# Altium schematic sheet 0024_DDR5 SODIMM CONTRO.SchDoc
size A3
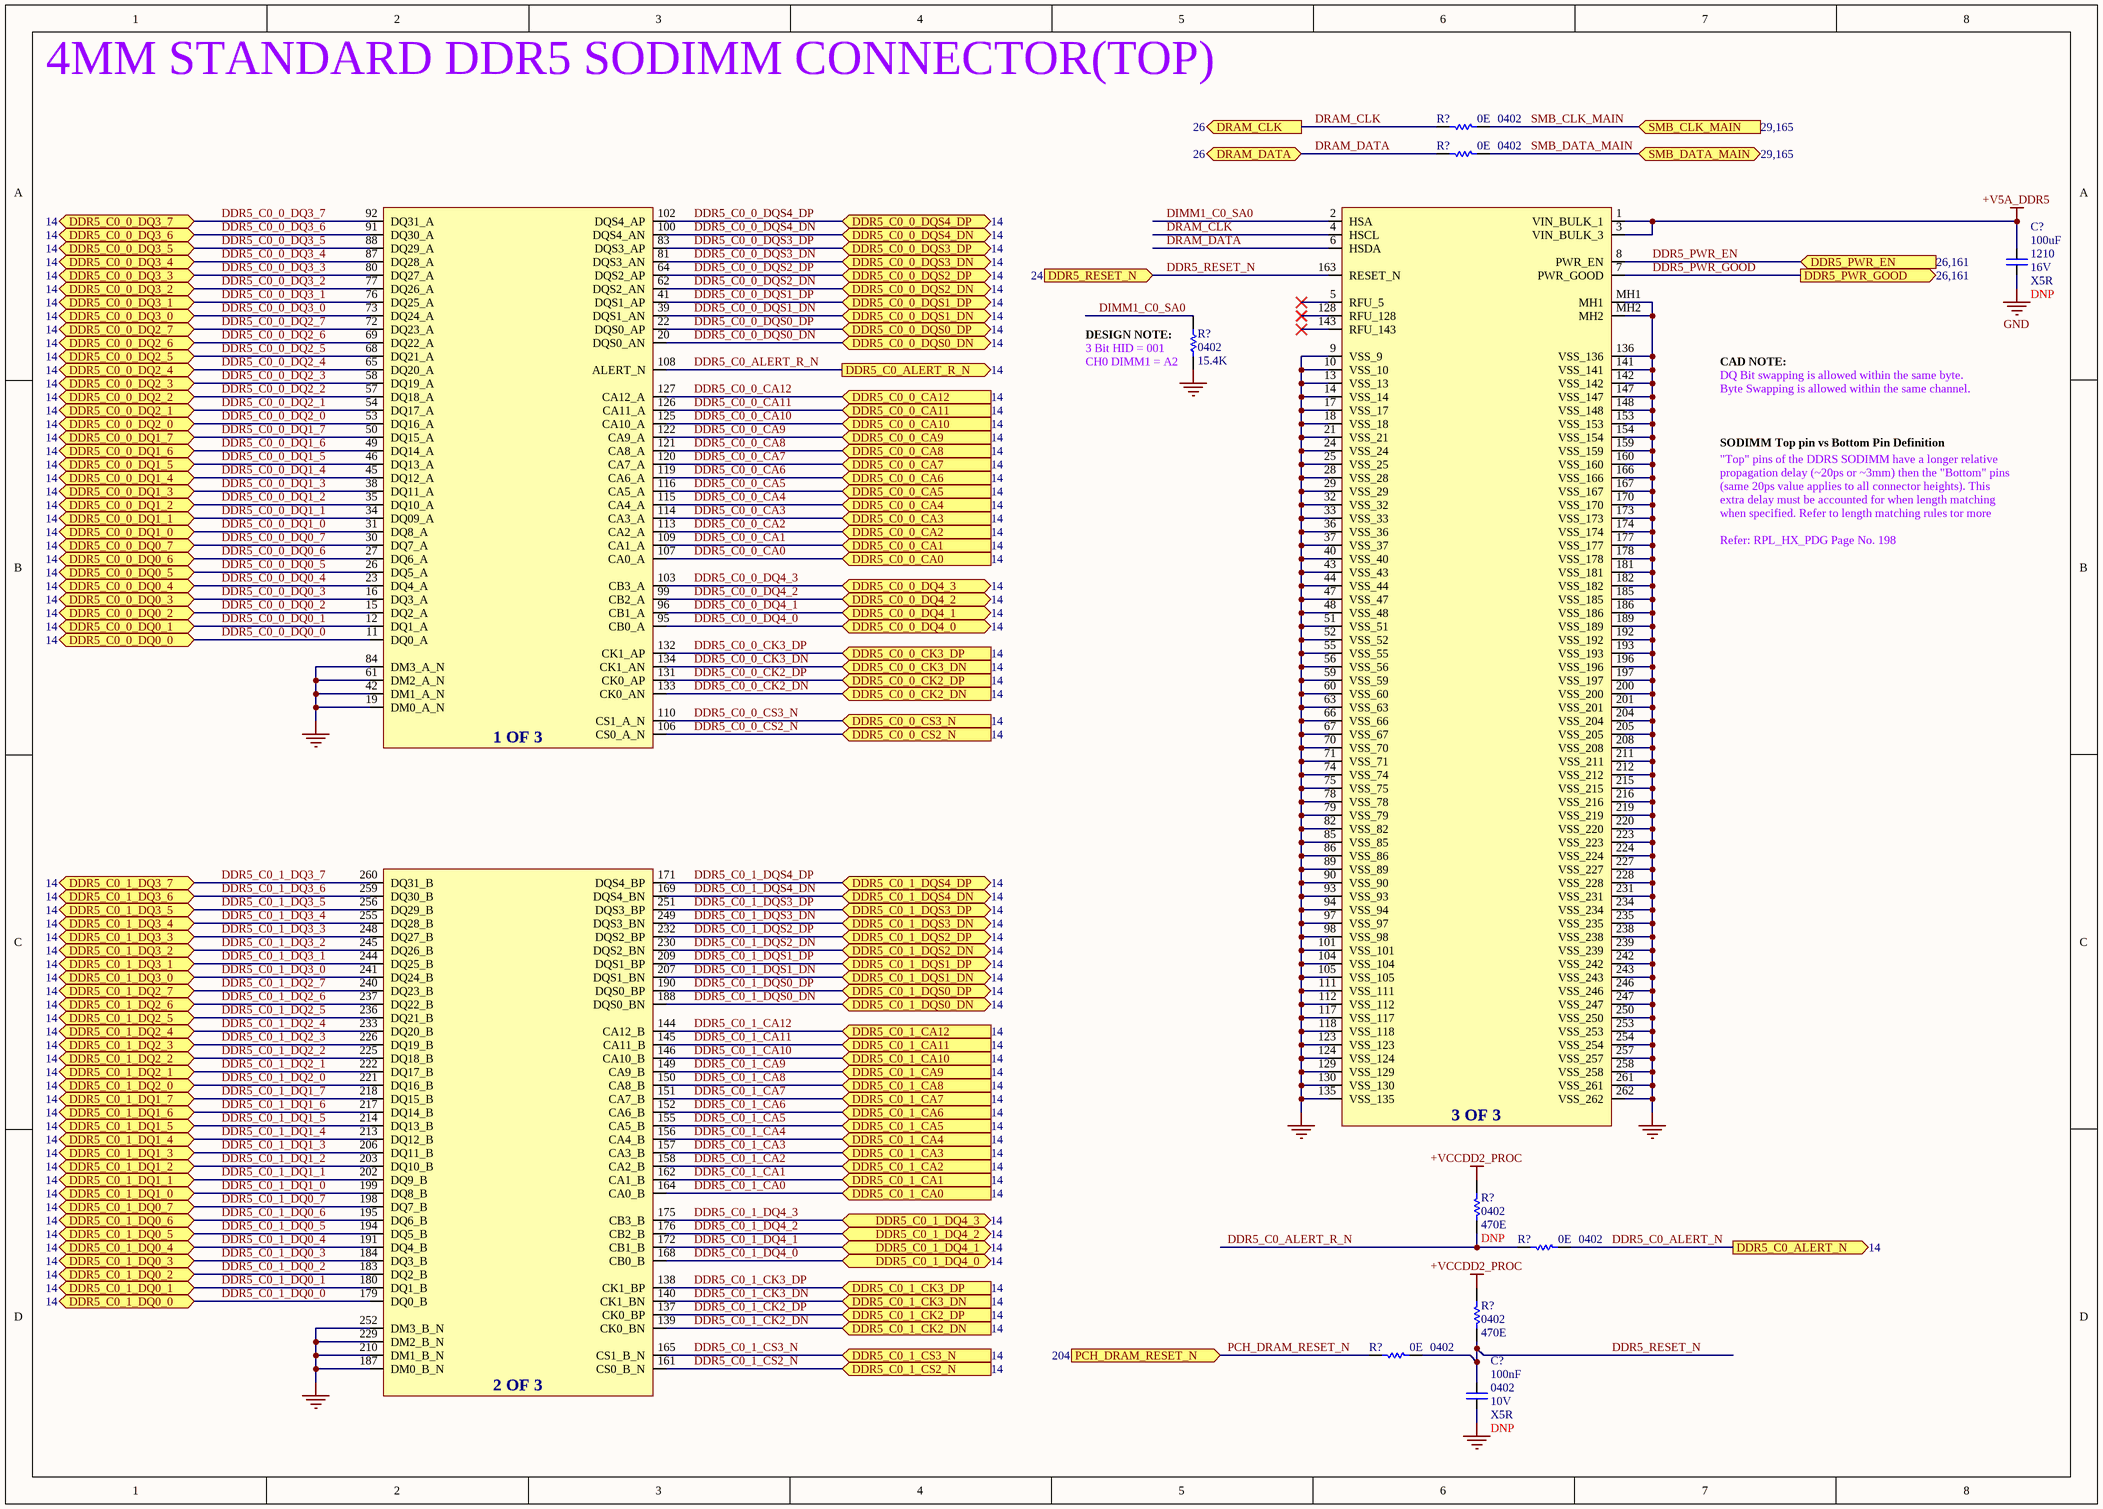
[diagram p0: 0024_DDR5 SODIMM CONTRO.SchDoc]

## Parts
(Parts that share a designator on the sheet are numbered #1, #2 ... from top to bottom, then left to right.)
C?#1  value 100uF  Case/Package: 1210  Voltage: 16V  Dielectric: X5R
C?#2  value 100nF  Case/Package: 0402  Voltage: 10V  Dielectric: X5R  [CAPC0402]
J2301  C_DDR5_SODIMM_2X131_2EM  (value not drawn)  (parts A,B,C of 3)
R?#1  value 0E  Case/Package: 0402  [RESC0402]  (hidden comment: Res)
R?#2  value 0E  Case/Package: 0402  [RESC0402]  (hidden comment: Res)
R?#3  value 15.4K  Case/Package: 0402  [RESC0402]  (hidden comment: Res)
R?#4  value 470E  Case/Package: 0402  [RESC0402]  (hidden comment: Res)
R?#5  value 0E  Case/Package: 0402  [RESC0402]  (hidden comment: Res)
R?#6  value 470E  Case/Package: 0402  [RESC0402]  (hidden comment: Res)
R?#7  value 0E  Case/Package: 0402  [RESC0402]  (hidden comment: Res)

## Ports
DDR5_C0_0_CA0 (in), DDR5_C0_0_CA1 (in), DDR5_C0_0_CA2 (in), DDR5_C0_0_CA3 (in), DDR5_C0_0_CA4 (in), DDR5_C0_0_CA5 (in), DDR5_C0_0_CA6 (in), DDR5_C0_0_CA7 (in), DDR5_C0_0_CA8 (in), DDR5_C0_0_CA9 (in), DDR5_C0_0_CA10 (in), DDR5_C0_0_CA11 (in), DDR5_C0_0_CA12 (in), DDR5_C0_0_CK2_DN (in), DDR5_C0_0_CK2_DP (in), DDR5_C0_0_CK3_DN (in), DDR5_C0_0_CK3_DP (in), DDR5_C0_0_CS2_N (in), DDR5_C0_0_CS3_N (in), DDR5_C0_0_DQ0_0 (bidir), DDR5_C0_0_DQ0_1 (bidir), DDR5_C0_0_DQ0_2 (bidir), DDR5_C0_0_DQ0_3 (bidir), DDR5_C0_0_DQ0_4 (bidir), DDR5_C0_0_DQ0_5 (bidir), DDR5_C0_0_DQ0_6 (bidir), DDR5_C0_0_DQ0_7 (bidir), DDR5_C0_0_DQ1_0 (bidir), DDR5_C0_0_DQ1_1 (bidir), DDR5_C0_0_DQ1_2 (bidir), DDR5_C0_0_DQ1_3 (bidir), DDR5_C0_0_DQ1_4 (bidir), DDR5_C0_0_DQ1_5 (bidir), DDR5_C0_0_DQ1_6 (bidir), DDR5_C0_0_DQ1_7 (bidir), DDR5_C0_0_DQ2_0 (bidir), DDR5_C0_0_DQ2_1 (bidir), DDR5_C0_0_DQ2_2 (bidir), DDR5_C0_0_DQ2_3 (bidir), DDR5_C0_0_DQ2_4 (bidir), DDR5_C0_0_DQ2_5 (bidir), DDR5_C0_0_DQ2_6 (bidir), DDR5_C0_0_DQ2_7 (bidir), DDR5_C0_0_DQ3_0 (bidir), DDR5_C0_0_DQ3_1 (bidir), DDR5_C0_0_DQ3_2 (bidir), DDR5_C0_0_DQ3_3 (bidir), DDR5_C0_0_DQ3_4 (bidir), DDR5_C0_0_DQ3_5 (bidir), DDR5_C0_0_DQ3_6 (bidir), DDR5_C0_0_DQ3_7 (bidir), DDR5_C0_0_DQ4_0 (bidir), DDR5_C0_0_DQ4_1 (bidir), DDR5_C0_0_DQ4_2 (bidir), DDR5_C0_0_DQ4_3 (bidir), DDR5_C0_0_DQS0_DN (bidir), DDR5_C0_0_DQS0_DP (bidir), DDR5_C0_0_DQS1_DN (bidir), DDR5_C0_0_DQS1_DP (bidir), DDR5_C0_0_DQS2_DN (bidir), DDR5_C0_0_DQS2_DP (bidir), DDR5_C0_0_DQS3_DN (bidir), DDR5_C0_0_DQS3_DP (bidir), DDR5_C0_0_DQS4_DN (bidir), DDR5_C0_0_DQS4_DP (bidir), DDR5_C0_1_CA0 (in), DDR5_C0_1_CA1 (in), DDR5_C0_1_CA2 (in), DDR5_C0_1_CA3 (in), DDR5_C0_1_CA4 (in), DDR5_C0_1_CA5 (in), DDR5_C0_1_CA6 (in), DDR5_C0_1_CA7 (in), DDR5_C0_1_CA8 (in), DDR5_C0_1_CA9 (in), DDR5_C0_1_CA10 (in), DDR5_C0_1_CA11 (in), DDR5_C0_1_CA12 (in), DDR5_C0_1_CK2_DN (in), DDR5_C0_1_CK2_DP (in), DDR5_C0_1_CK3_DN (in), DDR5_C0_1_CK3_DP (in), DDR5_C0_1_CS2_N (in), DDR5_C0_1_CS3_N (in), DDR5_C0_1_DQ0_0 (bidir), DDR5_C0_1_DQ0_1 (bidir), DDR5_C0_1_DQ0_2 (bidir), DDR5_C0_1_DQ0_3 (bidir), DDR5_C0_1_DQ0_4 (bidir), DDR5_C0_1_DQ0_5 (bidir), DDR5_C0_1_DQ0_6 (bidir), DDR5_C0_1_DQ0_7 (bidir), DDR5_C0_1_DQ1_0 (bidir), DDR5_C0_1_DQ1_1 (bidir), DDR5_C0_1_DQ1_2 (bidir), DDR5_C0_1_DQ1_3 (bidir), DDR5_C0_1_DQ1_4 (bidir), DDR5_C0_1_DQ1_5 (bidir), DDR5_C0_1_DQ1_6 (bidir), DDR5_C0_1_DQ1_7 (bidir), DDR5_C0_1_DQ2_0 (bidir), DDR5_C0_1_DQ2_1 (bidir), DDR5_C0_1_DQ2_2 (bidir), DDR5_C0_1_DQ2_3 (bidir), DDR5_C0_1_DQ2_4 (bidir), DDR5_C0_1_DQ2_5 (bidir), DDR5_C0_1_DQ2_6 (bidir), DDR5_C0_1_DQ2_7 (bidir), DDR5_C0_1_DQ3_0 (bidir), DDR5_C0_1_DQ3_1 (bidir), DDR5_C0_1_DQ3_2 (bidir), DDR5_C0_1_DQ3_3 (bidir), DDR5_C0_1_DQ3_4 (bidir), DDR5_C0_1_DQ3_5 (bidir), DDR5_C0_1_DQ3_6 (bidir), DDR5_C0_1_DQ3_7 (bidir), DDR5_C0_1_DQ4_0 (bidir), DDR5_C0_1_DQ4_1 (bidir), DDR5_C0_1_DQ4_2 (bidir), DDR5_C0_1_DQ4_3 (bidir), DDR5_C0_1_DQS0_DN (bidir), DDR5_C0_1_DQS0_DP (bidir), DDR5_C0_1_DQS1_DN (bidir), DDR5_C0_1_DQS1_DP (bidir), DDR5_C0_1_DQS2_DN (bidir), DDR5_C0_1_DQS2_DP (bidir), DDR5_C0_1_DQS3_DN (bidir), DDR5_C0_1_DQS3_DP (bidir), DDR5_C0_1_DQS4_DN (bidir), DDR5_C0_1_DQS4_DP (bidir), DDR5_C0_ALERT_N (out), DDR5_C0_ALERT_R_N (out), DDR5_PWR_EN (in), DDR5_PWR_GOOD (out), DDR5_RESET_N (in), DRAM_CLK (out), DRAM_DATA (bidir), PCH_DRAM_RESET_N (in), SMB_CLK_MAIN (in), SMB_DATA_MAIN (bidir)

## Nets
+V5A_DDR5: C?#1.1 J2301.1(VIN_BULK_1) J2301.3(VIN_BULK_3)
+VCCDD2_PROC: R?#4.2 R?#6.2
GND: C?#1.2 C?#2.2 J2301.9(VSS_9) J2301.10(VSS_10) J2301.13(VSS_13) J2301.14(VSS_14) J2301.17(VSS_17) J2301.18(VSS_18) J2301.19(DM0_A_N) J2301.21(VSS_21) J2301.24(VSS_24) J2301.25(VSS_25) J2301.28(VSS_28) J2301.29(VSS_29) J2301.32(VSS_32) J2301.33(VSS_33) J2301.36(VSS_36) J2301.37(VSS_37) J2301.40(VSS_40) J2301.42(DM1_A_N) J2301.43(VSS_43) J2301.44(VSS_44) J2301.47(VSS_47) J2301.48(VSS_48) J2301.51(VSS_51) J2301.52(VSS_52) J2301.55(VSS_55) J2301.56(VSS_56) J2301.59(VSS_59) J2301.60(VSS_60) J2301.61(DM2_A_N) J2301.63(VSS_63) J2301.66(VSS_66) J2301.67(VSS_67) J2301.70(VSS_70) J2301.71(VSS_71) J2301.74(VSS_74) J2301.75(VSS_75) J2301.78(VSS_78) J2301.79(VSS_79) J2301.82(VSS_82) J2301.84(DM3_A_N) J2301.85(VSS_85) J2301.86(VSS_86) J2301.89(VSS_89) J2301.90(VSS_90) J2301.93(VSS_93) J2301.94(VSS_94) J2301.97(VSS_97) J2301.98(VSS_98) J2301.101(VSS_101) J2301.104(VSS_104) J2301.105(VSS_105) J2301.111(VSS_111) J2301.112(VSS_112) J2301.117(VSS_117) J2301.118(VSS_118) J2301.123(VSS_123) J2301.124(VSS_124) J2301.129(VSS_129) J2301.130(VSS_130) J2301.135(VSS_135) J2301.136(VSS_136) J2301.141(VSS_141) J2301.142(VSS_142) J2301.147(VSS_147) J2301.148(VSS_148) J2301.153(VSS_153) J2301.154(VSS_154) J2301.159(VSS_159) J2301.160(VSS_160) J2301.166(VSS_166) J2301.167(VSS_167) J2301.170(VSS_170) J2301.173(VSS_173) J2301.174(VSS_174) J2301.177(VSS_177) J2301.178(VSS_178) J2301.181(VSS_181) J2301.182(VSS_182) J2301.185(VSS_185) J2301.186(VSS_186) J2301.187(DM0_B_N) J2301.189(VSS_189) J2301.192(VSS_192) J2301.193(VSS_193) J2301.196(VSS_196) J2301.197(VSS_197) J2301.200(VSS_200) J2301.201(VSS_201) J2301.204(VSS_204) J2301.205(VSS_205) J2301.208(VSS_208) J2301.210(DM1_B_N) J2301.211(VSS_211) J2301.212(VSS_212) J2301.215(VSS_215) J2301.216(VSS_216) J2301.219(VSS_219) J2301.220(VSS_220) J2301.223(VSS_223) J2301.224(VSS_224) J2301.227(VSS_227) J2301.228(VSS_228) J2301.229(DM2_B_N) J2301.231(VSS_231) J2301.234(VSS_234) J2301.235(VSS_235) J2301.238(VSS_238) J2301.239(VSS_239) J2301.242(VSS_242) J2301.243(VSS_243) J2301.246(VSS_246) J2301.247(VSS_247) J2301.250(VSS_250) J2301.252(DM3_B_N) J2301.253(VSS_253) J2301.254(VSS_254) J2301.257(VSS_257) J2301.258(VSS_258) J2301.261(VSS_261) J2301.262(VSS_262) J2301.MH1 J2301.MH2 R?#3.2
DDR5_C0_0_CA0: J2301.107(CA0_A) ; port DDR5_C0_0_CA0
DDR5_C0_0_CA1: J2301.109(CA1_A) ; port DDR5_C0_0_CA1
DDR5_C0_0_CA2: J2301.113(CA2_A) ; port DDR5_C0_0_CA2
DDR5_C0_0_CA3: J2301.114(CA3_A) ; port DDR5_C0_0_CA3
DDR5_C0_0_CA4: J2301.115(CA4_A) ; port DDR5_C0_0_CA4
DDR5_C0_0_CA5: J2301.116(CA5_A) ; port DDR5_C0_0_CA5
DDR5_C0_0_CA6: J2301.119(CA6_A) ; port DDR5_C0_0_CA6
DDR5_C0_0_CA7: J2301.120(CA7_A) ; port DDR5_C0_0_CA7
DDR5_C0_0_CA8: J2301.121(CA8_A) ; port DDR5_C0_0_CA8
DDR5_C0_0_CA9: J2301.122(CA9_A) ; port DDR5_C0_0_CA9
DDR5_C0_0_CA10: J2301.125(CA10_A) ; port DDR5_C0_0_CA10
DDR5_C0_0_CA11: J2301.126(CA11_A) ; port DDR5_C0_0_CA11
DDR5_C0_0_CA12: J2301.127(CA12_A) ; port DDR5_C0_0_CA12
DDR5_C0_0_CK2_DN: J2301.133(CK0_AN) ; port DDR5_C0_0_CK2_DN
DDR5_C0_0_CK2_DP: J2301.131(CK0_AP) ; port DDR5_C0_0_CK2_DP
DDR5_C0_0_CK3_DN: J2301.134(CK1_AN) ; port DDR5_C0_0_CK3_DN
DDR5_C0_0_CK3_DP: J2301.132(CK1_AP) ; port DDR5_C0_0_CK3_DP
DDR5_C0_0_CS2_N: J2301.106(CS0_A_N) ; port DDR5_C0_0_CS2_N
DDR5_C0_0_CS3_N: J2301.110(CS1_A_N) ; port DDR5_C0_0_CS3_N
DDR5_C0_0_DQ0_0: J2301.11(DQ0_A) ; port DDR5_C0_0_DQ0_0
DDR5_C0_0_DQ0_1: J2301.12(DQ1_A) ; port DDR5_C0_0_DQ0_1
DDR5_C0_0_DQ0_2: J2301.15(DQ2_A) ; port DDR5_C0_0_DQ0_2
DDR5_C0_0_DQ0_3: J2301.16(DQ3_A) ; port DDR5_C0_0_DQ0_3
DDR5_C0_0_DQ0_4: J2301.23(DQ4_A) ; port DDR5_C0_0_DQ0_4
DDR5_C0_0_DQ0_5: J2301.26(DQ5_A) ; port DDR5_C0_0_DQ0_5
DDR5_C0_0_DQ0_6: J2301.27(DQ6_A) ; port DDR5_C0_0_DQ0_6
DDR5_C0_0_DQ0_7: J2301.30(DQ7_A) ; port DDR5_C0_0_DQ0_7
DDR5_C0_0_DQ1_0: J2301.31(DQ8_A) ; port DDR5_C0_0_DQ1_0
DDR5_C0_0_DQ1_1: J2301.34(DQ09_A) ; port DDR5_C0_0_DQ1_1
DDR5_C0_0_DQ1_2: J2301.35(DQ10_A) ; port DDR5_C0_0_DQ1_2
DDR5_C0_0_DQ1_3: J2301.38(DQ11_A) ; port DDR5_C0_0_DQ1_3
DDR5_C0_0_DQ1_4: J2301.45(DQ12_A) ; port DDR5_C0_0_DQ1_4
DDR5_C0_0_DQ1_5: J2301.46(DQ13_A) ; port DDR5_C0_0_DQ1_5
DDR5_C0_0_DQ1_6: J2301.49(DQ14_A) ; port DDR5_C0_0_DQ1_6
DDR5_C0_0_DQ1_7: J2301.50(DQ15_A) ; port DDR5_C0_0_DQ1_7
DDR5_C0_0_DQ2_0: J2301.53(DQ16_A) ; port DDR5_C0_0_DQ2_0
DDR5_C0_0_DQ2_1: J2301.54(DQ17_A) ; port DDR5_C0_0_DQ2_1
DDR5_C0_0_DQ2_2: J2301.57(DQ18_A) ; port DDR5_C0_0_DQ2_2
DDR5_C0_0_DQ2_3: J2301.58(DQ19_A) ; port DDR5_C0_0_DQ2_3
DDR5_C0_0_DQ2_4: J2301.65(DQ20_A) ; port DDR5_C0_0_DQ2_4
DDR5_C0_0_DQ2_5: J2301.68(DQ21_A) ; port DDR5_C0_0_DQ2_5
DDR5_C0_0_DQ2_6: J2301.69(DQ22_A) ; port DDR5_C0_0_DQ2_6
DDR5_C0_0_DQ2_7: J2301.72(DQ23_A) ; port DDR5_C0_0_DQ2_7
DDR5_C0_0_DQ3_0: J2301.73(DQ24_A) ; port DDR5_C0_0_DQ3_0
DDR5_C0_0_DQ3_1: J2301.76(DQ25_A) ; port DDR5_C0_0_DQ3_1
DDR5_C0_0_DQ3_2: J2301.77(DQ26_A) ; port DDR5_C0_0_DQ3_2
DDR5_C0_0_DQ3_3: J2301.80(DQ27_A) ; port DDR5_C0_0_DQ3_3
DDR5_C0_0_DQ3_4: J2301.87(DQ28_A) ; port DDR5_C0_0_DQ3_4
DDR5_C0_0_DQ3_5: J2301.88(DQ29_A) ; port DDR5_C0_0_DQ3_5
DDR5_C0_0_DQ3_6: J2301.91(DQ30_A) ; port DDR5_C0_0_DQ3_6
DDR5_C0_0_DQ3_7: J2301.92(DQ31_A) ; port DDR5_C0_0_DQ3_7
DDR5_C0_0_DQ4_0: J2301.95(CB0_A) ; port DDR5_C0_0_DQ4_0
DDR5_C0_0_DQ4_1: J2301.96(CB1_A) ; port DDR5_C0_0_DQ4_1
DDR5_C0_0_DQ4_2: J2301.99(CB2_A) ; port DDR5_C0_0_DQ4_2
DDR5_C0_0_DQ4_3: J2301.103(CB3_A) ; port DDR5_C0_0_DQ4_3
DDR5_C0_0_DQS0_DN: J2301.20(DQS0_AN) ; port DDR5_C0_0_DQS0_DN
DDR5_C0_0_DQS0_DP: J2301.22(DQS0_AP) ; port DDR5_C0_0_DQS0_DP
DDR5_C0_0_DQS1_DN: J2301.39(DQS1_AN) ; port DDR5_C0_0_DQS1_DN
DDR5_C0_0_DQS1_DP: J2301.41(DQS1_AP) ; port DDR5_C0_0_DQS1_DP
DDR5_C0_0_DQS2_DN: J2301.62(DQS2_AN) ; port DDR5_C0_0_DQS2_DN
DDR5_C0_0_DQS2_DP: J2301.64(DQS2_AP) ; port DDR5_C0_0_DQS2_DP
DDR5_C0_0_DQS3_DN: J2301.81(DQS3_AN) ; port DDR5_C0_0_DQS3_DN
DDR5_C0_0_DQS3_DP: J2301.83(DQS3_AP) ; port DDR5_C0_0_DQS3_DP
DDR5_C0_0_DQS4_DN: J2301.100(DQS4_AN) ; port DDR5_C0_0_DQS4_DN
DDR5_C0_0_DQS4_DP: J2301.102(DQS4_AP) ; port DDR5_C0_0_DQS4_DP
DDR5_C0_1_CA0: J2301.164(CA0_B) ; port DDR5_C0_1_CA0
DDR5_C0_1_CA1: J2301.162(CA1_B) ; port DDR5_C0_1_CA1
DDR5_C0_1_CA2: J2301.158(CA2_B) ; port DDR5_C0_1_CA2
DDR5_C0_1_CA3: J2301.157(CA3_B) ; port DDR5_C0_1_CA3
DDR5_C0_1_CA4: J2301.156(CA4_B) ; port DDR5_C0_1_CA4
DDR5_C0_1_CA5: J2301.155(CA5_B) ; port DDR5_C0_1_CA5
DDR5_C0_1_CA6: J2301.152(CA6_B) ; port DDR5_C0_1_CA6
DDR5_C0_1_CA7: J2301.151(CA7_B) ; port DDR5_C0_1_CA7
DDR5_C0_1_CA8: J2301.150(CA8_B) ; port DDR5_C0_1_CA8
DDR5_C0_1_CA9: J2301.149(CA9_B) ; port DDR5_C0_1_CA9
DDR5_C0_1_CA10: J2301.146(CA10_B) ; port DDR5_C0_1_CA10
DDR5_C0_1_CA11: J2301.145(CA11_B) ; port DDR5_C0_1_CA11
DDR5_C0_1_CA12: J2301.144(CA12_B) ; port DDR5_C0_1_CA12
DDR5_C0_1_CK2_DN: J2301.139(CK0_BN) ; port DDR5_C0_1_CK2_DN
DDR5_C0_1_CK2_DP: J2301.137(CK0_BP) ; port DDR5_C0_1_CK2_DP
DDR5_C0_1_CK3_DN: J2301.140(CK1_BN) ; port DDR5_C0_1_CK3_DN
DDR5_C0_1_CK3_DP: J2301.138(CK1_BP) ; port DDR5_C0_1_CK3_DP
DDR5_C0_1_CS2_N: J2301.161(CS0_B_N) ; port DDR5_C0_1_CS2_N
DDR5_C0_1_CS3_N: J2301.165(CS1_B_N) ; port DDR5_C0_1_CS3_N
DDR5_C0_1_DQ0_0: J2301.179(DQ0_B) ; port DDR5_C0_1_DQ0_0
DDR5_C0_1_DQ0_1: J2301.180(DQ1_B) ; port DDR5_C0_1_DQ0_1
DDR5_C0_1_DQ0_2: J2301.183(DQ2_B) ; port DDR5_C0_1_DQ0_2
DDR5_C0_1_DQ0_3: J2301.184(DQ3_B) ; port DDR5_C0_1_DQ0_3
DDR5_C0_1_DQ0_4: J2301.191(DQ4_B) ; port DDR5_C0_1_DQ0_4
DDR5_C0_1_DQ0_5: J2301.194(DQ5_B) ; port DDR5_C0_1_DQ0_5
DDR5_C0_1_DQ0_6: J2301.195(DQ6_B) ; port DDR5_C0_1_DQ0_6
DDR5_C0_1_DQ0_7: J2301.198(DQ7_B) ; port DDR5_C0_1_DQ0_7
DDR5_C0_1_DQ1_0: J2301.199(DQ8_B) ; port DDR5_C0_1_DQ1_0
DDR5_C0_1_DQ1_1: J2301.202(DQ9_B) ; port DDR5_C0_1_DQ1_1
DDR5_C0_1_DQ1_2: J2301.203(DQ10_B) ; port DDR5_C0_1_DQ1_2
DDR5_C0_1_DQ1_3: J2301.206(DQ11_B) ; port DDR5_C0_1_DQ1_3
DDR5_C0_1_DQ1_4: J2301.213(DQ12_B) ; port DDR5_C0_1_DQ1_4
DDR5_C0_1_DQ1_5: J2301.214(DQ13_B) ; port DDR5_C0_1_DQ1_5
DDR5_C0_1_DQ1_6: J2301.217(DQ14_B) ; port DDR5_C0_1_DQ1_6
DDR5_C0_1_DQ1_7: J2301.218(DQ15_B) ; port DDR5_C0_1_DQ1_7
DDR5_C0_1_DQ2_0: J2301.221(DQ16_B) ; port DDR5_C0_1_DQ2_0
DDR5_C0_1_DQ2_1: J2301.222(DQ17_B) ; port DDR5_C0_1_DQ2_1
DDR5_C0_1_DQ2_2: J2301.225(DQ18_B) ; port DDR5_C0_1_DQ2_2
DDR5_C0_1_DQ2_3: J2301.226(DQ19_B) ; port DDR5_C0_1_DQ2_3
DDR5_C0_1_DQ2_4: J2301.233(DQ20_B) ; port DDR5_C0_1_DQ2_4
DDR5_C0_1_DQ2_5: J2301.236(DQ21_B) ; port DDR5_C0_1_DQ2_5
DDR5_C0_1_DQ2_6: J2301.237(DQ22_B) ; port DDR5_C0_1_DQ2_6
DDR5_C0_1_DQ2_7: J2301.240(DQ23_B) ; port DDR5_C0_1_DQ2_7
DDR5_C0_1_DQ3_0: J2301.241(DQ24_B) ; port DDR5_C0_1_DQ3_0
DDR5_C0_1_DQ3_1: J2301.244(DQ25_B) ; port DDR5_C0_1_DQ3_1
DDR5_C0_1_DQ3_2: J2301.245(DQ26_B) ; port DDR5_C0_1_DQ3_2
DDR5_C0_1_DQ3_3: J2301.248(DQ27_B) ; port DDR5_C0_1_DQ3_3
DDR5_C0_1_DQ3_4: J2301.255(DQ28_B) ; port DDR5_C0_1_DQ3_4
DDR5_C0_1_DQ3_5: J2301.256(DQ29_B) ; port DDR5_C0_1_DQ3_5
DDR5_C0_1_DQ3_6: J2301.259(DQ30_B) ; port DDR5_C0_1_DQ3_6
DDR5_C0_1_DQ3_7: J2301.260(DQ31_B) ; port DDR5_C0_1_DQ3_7
DDR5_C0_1_DQ4_0: J2301.168(CB0_B) ; port DDR5_C0_1_DQ4_0
DDR5_C0_1_DQ4_1: J2301.172(CB1_B) ; port DDR5_C0_1_DQ4_1
DDR5_C0_1_DQ4_2: J2301.176(CB2_B) ; port DDR5_C0_1_DQ4_2
DDR5_C0_1_DQ4_3: J2301.175(CB3_B) ; port DDR5_C0_1_DQ4_3
DDR5_C0_1_DQS0_DN: J2301.188(DQS0_BN) ; port DDR5_C0_1_DQS0_DN
DDR5_C0_1_DQS0_DP: J2301.190(DQS0_BP) ; port DDR5_C0_1_DQS0_DP
DDR5_C0_1_DQS1_DN: J2301.207(DQS1_BN) ; port DDR5_C0_1_DQS1_DN
DDR5_C0_1_DQS1_DP: J2301.209(DQS1_BP) ; port DDR5_C0_1_DQS1_DP
DDR5_C0_1_DQS2_DN: J2301.230(DQS2_BN) ; port DDR5_C0_1_DQS2_DN
DDR5_C0_1_DQS2_DP: J2301.232(DQS2_BP) ; port DDR5_C0_1_DQS2_DP
DDR5_C0_1_DQS3_DN: J2301.249(DQS3_BN) ; port DDR5_C0_1_DQS3_DN
DDR5_C0_1_DQS3_DP: J2301.251(DQS3_BP) ; port DDR5_C0_1_DQS3_DP
DDR5_C0_1_DQS4_DN: J2301.169(DQS4_BN) ; port DDR5_C0_1_DQS4_DN
DDR5_C0_1_DQS4_DP: J2301.171(DQS4_BP) ; port DDR5_C0_1_DQS4_DP
DDR5_C0_ALERT_N: R?#5.2 ; port DDR5_C0_ALERT_N
DDR5_C0_ALERT_R_N: J2301.108(ALERT_N) R?#4.1 R?#5.1 ; port DDR5_C0_ALERT_R_N
DDR5_PWR_EN: J2301.8(PWR_EN) ; port DDR5_PWR_EN
DDR5_PWR_GOOD: J2301.7(PWR_GOOD) ; port DDR5_PWR_GOOD
DDR5_RESET_N: C?#2.1 J2301.163(RESET_N) R?#6.1 R?#7.2 ; port DDR5_RESET_N
DIMM1_C0_SA0: J2301.2(HSA) R?#3.1
DRAM_CLK: J2301.4(HSCL) R?#1.1 ; port DRAM_CLK
DRAM_DATA: J2301.6(HSDA) R?#2.1 ; port DRAM_DATA
PCH_DRAM_RESET_N: R?#7.1 ; port PCH_DRAM_RESET_N
SMB_CLK_MAIN: R?#1.2 ; port SMB_CLK_MAIN
SMB_DATA_MAIN: R?#2.2 ; port SMB_DATA_MAIN

Not connected (* = marked no-connect by the designer): J2301 5(RFU_5)* 128(RFU_128)* 143(RFU_143)*

## Notes on the sheet
- 4MM STANDARD DDR5 SODIMM CONNECTOR(TOP)
- (near R?#3) DESIGN NOTE:
- (near R?#3) 3 Bit HID = 001
- (near R?#3) CH0 DIMM1 = A2
- CAD NOTE:
- DQ Bit swapping is allowed within the same byte.
- Byte Swapping is allowed within the same channel.
- SODIMM Top pin vs Bottom Pin Definition
- "Top" pins of the DDRS SODIMM have a longer relative propagation delay (~20ps or ~3mm) then the "Bottom" pins (same 20ps value applies to all connector heights). This extra delay must be accounted for when length matching when specified. Refer to length matching rules tor more details
- Refer: RPL_HX_PDG Page No. 198
- (in symbol C_DDR5_SODIMM_2X131_2EM, part A) 1 OF 3
- (in symbol C_DDR5_SODIMM_2X131_2EM, part B) 2 OF 3
- (in symbol C_DDR5_SODIMM_2X131_2EM, part C) 3 OF 3

## Library data of the parts
C?#1 = Cap: CAP CER 100uF 16V X5R 1210; DNP: DNP
C?#2 = Cap: CAP CER 100nF 10V X5R 0402; DNP: DNP
R?#1 R?#2 R?#5 R?#7 = Res: Thick Film Resistor -  0ohm, 1%, 0402
R?#3 = Res: Thick Film Resistor -  15.4Kohm, 1%, 0402
R?#4 R?#6 = Res: Thick Film Resistor -  470ohm, 1%, 0402
  R?#4: DNP: DNP
J2301 = C_DDR5_SODIMM_2X131_2EM: Manufacturer Part Number: *; Case/Package: *